# Altium schematic sheet 1.Power_Supply.SchDoc: 1. Power Supply
size A4; CompanyName: Keri Studio; DrawnBy: Ashis Talaviya; Organization: KERI STUDIO; Address1: ICG COMPOUND; Address2: NR. BHAVANI CIRCLE; Address3: A.K. ROAD; Address4: SURAT-395008; DocumentNumber: 1; Revision: 1.0; SheetNumber: 1; SheetTotal: 4
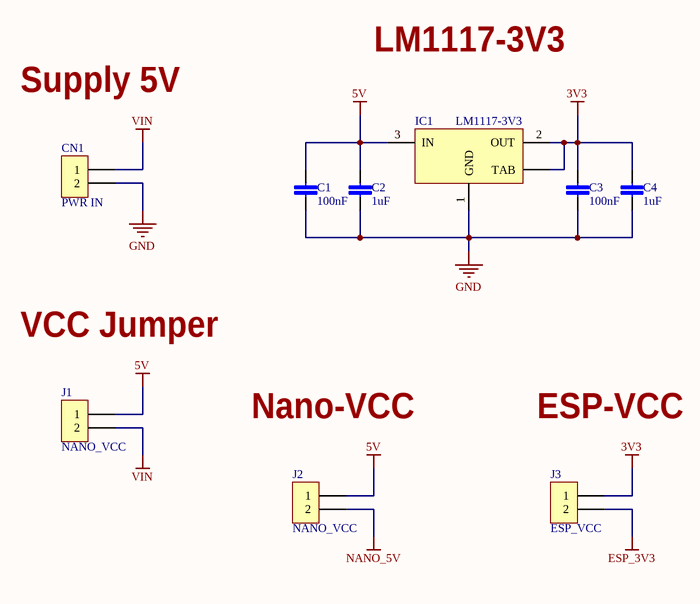
[diagram p0: 1.Power_Supply.SchDoc]

## Parts
C1  100nF  [C0805]
C2  1uF  [C0805]
C3  100nF  [C0805]
C4  1uF  [C0805]
CN1  PWR IN  [Terminal_5.08mm_1X02]
IC1  LM1117-3V3  [SOT223]
J1  NANO_VCC  [Header_2.54mm_1X02]
J2  NANO_VCC  [Header_2.54mm_1X02]
J3  ESP_VCC  [Header_2.54mm_1X02]

## Nets
3V3: C3.1 C4.1 IC1.2(OUT) IC1.4(TAB) J3.1
5V: C1.1 C2.1 IC1.3(IN) J1.1 J2.1
ESP_3V3: J3.2
GND: C1.2 C2.2 C3.2 C4.2 CN1.2 IC1.1(GND)
NANO_5V: J2.2
VIN: CN1.1 J1.2

## Notes on the sheet
- LM1117-3V3
- Supply 5V
- VCC Jumper
- Nano-VCC
- ESP-VCC
- Title
- Size:
- A4
- Number:
- Revision:
- Date:
- Time:
- Sheet
- of

## Library data of the parts
C1 C3 = C_0805_0.1uF: Multilayer Ceramic Capacitors MLCC - SMD/SMT 0805 0.1uF 50volts X7R 20%; Manufacturer: Murata; Manufacturer Part Number: GCJ21BR71H104MA01L; Supplier 1: Mouser; Supplier Part Number 1: 81-GCJ21BR71H104MA1L; Stock 1: 0
C2 C4 = C_0805_1uF: Multilayer Ceramic Capacitors MLCC - SMD/SMT 0805 1uF 50volts X7R 20%; Manufacturer: Murata; Manufacturer Part Number: GCJ21BR71H105MA01L; Supplier 1: Mouser; Supplier Part Number 1: 81-GCJ21BR71H105MA1L; Stock 1: 0; Pricing 1: 1=0.33, 10=0.231, 50=0.231, 100=0.139, 1000=0.088, 10000=0.074 (USD)
CN1 = Terminal_5.08mm_1X02: Fixed Terminal Blocks TERMI-BLOK PCB; Manufacturer: TE Connectivity; Manufacturer Part Number: 796682-2; Plating: Brass,Nickel; Number of Positions: 2; Number of Levels: 1; Current: 17.5A; Voltage: 300V; Connector Type: Receptacle; Closed End: No (Without); Interlock: Yes (With); Wire Gauge (Max): 30AWG; Pitch: 5mm; Thread Size: M3; Tail Length: 3.5mm; Supplier 1: Mouser; Stock 1: 1299; Pricing 1: 1=1.06, 10=0.737, 50=0.623, 100=0.62, 1000=0.441, 10000=0.367 (USD); Mount: Through Hole; Contact Plating: Tin; Contact Material: Brass; Colour: Black; Housing Material: Polyamide; Housing Colour: Black; Min Operating Temperature: -40°C; Max Operating Temperature: 105°C; Number of Rows: 1; Packaging: Bulk; Package Quantity: 300; Termination: Solder; Number of Positions Per Level: 2; Orientation: Straight; Max Current Rating: 17.5A; Current Rating: 17.5A; Voltage Rating: 300V; Number of Contacts: 2; Max Voltage Rating (AC): 300V; Number of Circuits: 2; Max Supply Voltage (AC): 300V; Screw Flange: No (Without); Screwless Terminal Block: No (Without); Side Stackable: No (Without); Length: 10.5mm; Height: 15.5mm; Wire Gauge (Min): 30AWG; Depth: 9mm; Width: 9mm; Radiation Hardening: No; Flammability Rating: UL94 V-0; Lead Free: Lead Free; ELV: Compliant; ComponentLink1URL: http://components.arrow.com/part/dataview/0323_03914338; ComponentLink1Description: http://components.arrow.com/part/dataview/0323_03914338; ComponentLink2URL: http://www.onlinecomponents.com/productFiles/mf-AMP/eng_cs_1308389_eurostyle_terminal_blocks_0607.pdf; ComponentLink2Description: http://www.onlinecomponents.com/productFiles/mf-AMP/eng_cs_1308389_eurostyle_terminal_blocks_0607.pdf; ComponentLink3URL: http://www.jameco.com/Jameco/Products/ProdDS/759341.pdf; ComponentLink3Description: http://www.jameco.com/Jameco/Products/ProdDS/759341.pdf; ComponentLink4URL: http://www.te.com/commerce/DocumentDelivery/DDEController?Action=showdoc&DocId=Catalog+Section%7F1308389_EUROSTYLE_TERMINAL_BLOCKS%7F0607%7Fpdf%7FEnglish%7FENG_CS_1308389_EUROSTYLE_TERMINAL_BLOCKS_0607.pdf; ComponentLink4Description: http://www.te.com/commerce/DocumentDelivery/DDEController?Action=showdoc&DocId=Catalog+Section%7F1308389_EUROSTYLE_TERMINAL_BLOCKS%7F0607%7Fpdf%7FEnglish%7FENG_CS_1308389_EUROSTYLE_TERMINAL_BLOCKS_0607.pdf; ComponentLink5URL: http://components.arrow.com/part/dataview/3050970S8348740N5665; ComponentLink5Description: http://components.arrow.com/part/dataview/3050970S8348740N5665; ComponentLink6URL: http://www.te.com/catalog/pn/en/796682-2?RQPN=796682-2; ComponentLink6Description: http://www.te.com/catalog/pn/en/796682-2?RQPN=796682-2; ComponentLink7URL: http://www.te.com/commerce/DocumentDelivery/DDEController?Action=srchrtrv&DocNm=796682&DocType=Customer+Drawing&DocLang=English; ComponentLink7Description: http://www.te.com/commerce/DocumentDelivery/DDEController?Action=srchrtrv&DocNm=796682&DocType=Customer+Drawing&DocLang=English; Supplier Part Number 1: 571-796682-2
IC1 = VREG_LM1117_3V3: IC, LINEAR VOLTAGE REGULATOR; Manufacturer: TI National Semiconductor; Manufacturer Part Number: LM1117MPX-3.3; Number of Outputs: 1; Output Voltage: 3.3V; Quiescent Current: 10mA; Output Current: 800mA; Dropout Voltage: 1.2V; Max Input Voltage: 15V; Polarity: Positive; Accuracy: 1%; Min Supply Voltage: 4.75V; Supplier 1: Mouser; Supplier Part Number 1: 926-LM1117MPX-33; Stock 1: 1423; Pricing 1: 1=1.54, 10=1.32, 50=1.32, 100=1.01, 1000=0.702, 10000=0.6 (USD); Mount: Surface Mount; Case/Package: SOT-223; Number of Pins: 4; Min Operating Temperature: -40°C; Max Operating Temperature: 125°C; Packaging: Tape and Reel; Current Rating: 800mA; Max Output Current: 800mA; Output Voltage Accuracy: 1%; Number of Regulators: 1; Min Current Limit: 800mA; Max Output Voltage: 3.3V; Max Supply Voltage: 15V; Termination: SMD/SMT; REACH SVHC: No SVHC; Lead Free: Contains Lead; ComponentLink1URL: https://datasheet.ciiva.com/8042/1882372-8042277.pdf; ComponentLink1Description: https://datasheet.ciiva.com/8042/1882372-8042277.pdf; ComponentLink2URL: https://datasheet.ciiva.com/1570/1831038-1570214.pdf; ComponentLink2Description: https://datasheet.ciiva.com/1570/1831038-1570214.pdf; ComponentLink3URL: https://datasheet.ciiva.com/1570/1772317-1570215.pdf; ComponentLink3Description: https://datasheet.ciiva.com/1570/1772317-1570215.pdf
J1-J3 = Header_2.54mm_1X02: TE Connectivity AMPMODU Mod II Series, 2.54mm Pitch 2 Way 1 Row Straight Breakaway Header, Solder Termination, 3A; Manufacturer Part Number: 826646-2; Number of Contacts: 2; Connector Type: Plug,Pin,Header; Board Standoff: No (Without); Plating Thickness: 0.8um; High Speed Serial Data Connector: No; PCB Mount Retention: Without; Mating Post Length: 5.8mm; Supplier 1: Mouser; Manufacturer: TE Connectivity; Stock 1: 37059; Pricing 1: 1=0.37, 10=0.343, 50=0.343, 100=0.263, 1000=0.189, 10000=0.157 (USD); Mount: Straddle Mount; Contact Plating: Tin,Gold; Colour: Green; Contact Material: Bronze; Housing Material: PBT; Housing Colour: Green; Contact Shape: Square; Min Operating Temperature: -65°C; Max Operating Temperature: 105°C; Number of Rows: 1; Termination: Through Hole; Packaging: Carton; Current Rating: 3A; Package Quantity: 3000; Contact Gender: Male; Number of Positions: 2; Orientation: Straight; Contact Protection: No (Without); Gasket: No (Without); High Temperature Housing: No; Keyed: No; Mating Alignment: No (Without); Mating Connector Lock: No (Without); Selectively Loaded: No (Without); Stabilizers: No (Without); Strain Relief: No (Without); Length: 5.08mm; Pitch: 2.54mm; Contact Mating Length: 0.228inch; Row Spacing: 2.54mm; Termination Post Length: 0.1259inch; Depth: 2.5mm; Radiation Hardening: No; Flammability Rating: UL94 V-0; ELV: Compliant; Lead Free: Lead Free; ComponentLink1URL: https://datasheet.ciiva.com/11746/0900766b80d7c469-11746485.pdf; ComponentLink1Description: https://datasheet.ciiva.com/11746/0900766b80d7c469-11746485.pdf; ComponentLink2URL: https://datasheet.ciiva.com/31842/8266462-31842526.pdf; ComponentLink2Description: https://datasheet.ciiva.com/31842/8266462-31842526.pdf; ComponentLink3URL: https://datasheet.ciiva.com/29369/001094740-da-01-en-stiftleiste-1-reihig-0-0826646-2-29369543.pdf; ComponentLink3Description: https://datasheet.ciiva.com/29369/001094740-da-01-en-stiftleiste-1-reihig-0-0826646-2-29369543.pdf; ComponentLink4URL: https://datasheet.ciiva.com/735/eng-cd-826629-aa-basefilename-735038.pdf; ComponentLink4Description: https://datasheet.ciiva.com/735/eng-cd-826629-aa-basefilename-735038.pdf; Supplier Part Number 1: 571-826646-2